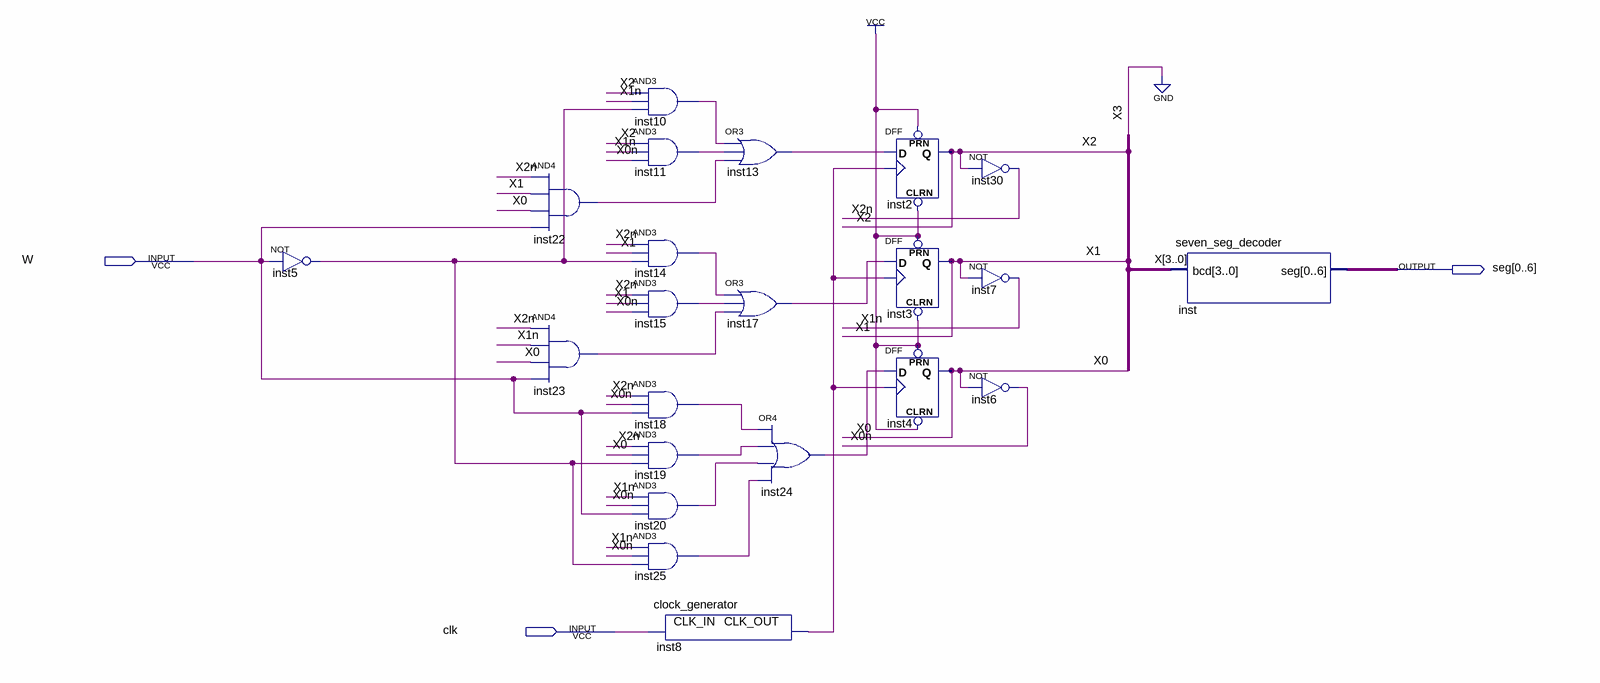
[diagram p0: schematic sheet]
// Quartus schematic lab11.bdf as structural Verilog: 22 symbols, 3 pins
module lab11 (
  input  W,
  input  clk,
  output [0:6] seg
);

  wire inst5_out, inst8_clk_out, inst10_out, inst11_out, inst13_out, inst14_out, inst15_out, inst17_out,
       inst18_out, inst19_out, inst20_out, inst22_out, inst23_out, inst24_out, inst25_out, X0n, X1n, X2n;
  wire [2:0] X;

  not inst5 (inst5_out, W);
  and inst22 (inst22_out, X2n, X[1], X[0], W);
  and inst23 (inst23_out, X2n, X1n, X[0], W);
  and inst10 (inst10_out, X[2], X1n, inst5_out);
  and inst11 (inst11_out, X[2], X1n, X0n);
  and inst14 (inst14_out, X2n, X[1], inst5_out);
  and inst15 (inst15_out, X2n, X[1], X0n);
  and inst18 (inst18_out, X2n, X0n, W);
  and inst19 (inst19_out, X2n, X[0], inst5_out);
  and inst20 (inst20_out, X1n, X0n, W);
  and inst25 (inst25_out, X1n, X0n, inst5_out);
  clock_generator inst8 (.CLK_IN(clk), .CLK_OUT(inst8_clk_out));
  or inst13 (inst13_out, inst10_out, inst11_out, inst22_out);
  or inst17 (inst17_out, inst14_out, inst15_out, inst23_out);
  or inst24 (inst24_out, inst18_out, inst19_out, inst20_out, inst25_out);
  DFF inst2 (.CLRN(1'b1), .CLK(inst8_clk_out), .D(inst13_out), .PRN(1'b1), .Q(X[2]));
  DFF inst3 (.CLRN(1'b1), .CLK(inst8_clk_out), .D(inst17_out), .PRN(1'b1), .Q(X[1]));
  DFF inst4 (.CLRN(1'b1), .CLK(inst8_clk_out), .D(inst24_out), .PRN(1'b1), .Q(X[0]));
  not inst30 (X2n, X[2]);
  not inst7 (X1n, X[1]);
  not inst6 (X0n, X[0]);
  seven_seg_decoder inst (.bcd({1'b0, X}), .seg(seg));
endmodule
